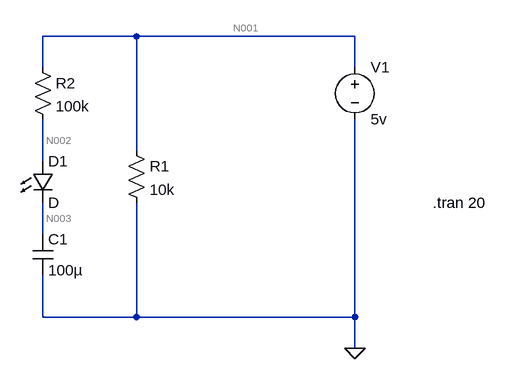
[diagram p0: schematic 37#24.5_2.(2d).(1-cap,R2-100k,1-LED).asc]
37#24.5_2.(2d).(1-cap,R2-100k,1-LED).asc, the LTspice schematic file:
Version 4
SHEET 1 880 680
WIRE -128 -432 -272 -432
WIRE 208 -432 -128 -432
WIRE -272 -384 -272 -432
WIRE 208 -384 208 -432
WIRE -128 -256 -128 -432
WIRE -272 -240 -272 -304
WIRE -272 -128 -272 -176
WIRE -272 0 -272 -64
WIRE -128 0 -128 -176
WIRE -128 0 -272 0
WIRE 208 0 208 -304
WIRE 208 0 -128 0
WIRE 208 48 208 0
FLAG 208 48 0
SYMBOL voltage 208 -400 R0
WINDOW 123 0 0 Left 2
WINDOW 39 0 0 Left 2
SYMATTR InstName V1
SYMATTR Value 5v
SYMBOL res -144 -272 R0
SYMATTR InstName R1
SYMATTR Value 10k
SYMBOL res -288 -400 R0
SYMATTR InstName R2
SYMATTR Value 100k
SYMBOL cap -288 -128 R0
SYMATTR InstName C1
SYMATTR Value 100µ
SYMBOL LED -288 -240 R0
SYMATTR InstName D1
TEXT 328 -176 Left 2 !.tran 20

The netlist it stands for:
* 37#24.5_2.(2d).(1-cap,R2-100k,1-LED).asc
V1 N001 0 5v
R1 N001 0 10k
R2 N001 N002 100k
C1 N003 0 100µ
D1 N002 N003 D
.model D D
.lib standard.dio
.tran 20
.backanno
.end

* Results of the author's LTspice run, read from the files saved beside the schematic
* Operating Point, zero values left out:
*   V(n001) = 5 V
*   V(n002) = 5 V
*   V(n003) = 5 V
*   I(R1) = 500 µA
*   I(V1) = -500 µA